# Altium schematic sheet Sheet1.SchDoc
size A4
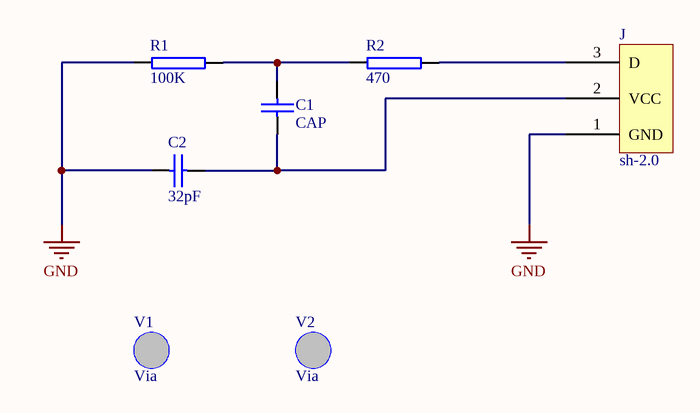
[diagram p0: Sheet1.SchDoc]

## Parts
C1  CAP
C2  32pF  [1608[0603]]
J  sh-2.0  [sh-2.0]
R1  100K  [1608[0603]]
R2  470  [1608[0603]]
V1  Via  [Via]
V2  Via  [Via]

## Nets
GND: C2.1 J.1(GND) R1.1
NetC1_1: C1.1 R1.2 R2.1
NetC1_2: C1.2 C2.2 J.2(VCC)
NetJ_3: J.3(D) R2.2

## Library data of the parts
C2 = CAP
J = sh-2.0: pin to pad: 1>3 3>1
R1 R2 = RES